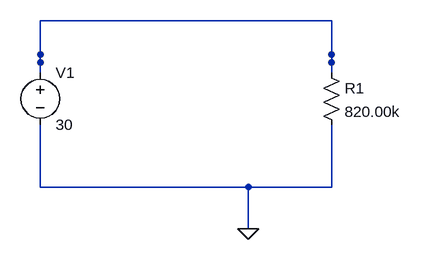
[diagram p0: schematic pannel3.asc]
pannel3.asc, the LTspice schematic file:
Version 4
SHEET 1 880 680
WIRE 640 336 640 308
WIRE 640 448 640 416
SYMBOL res 624 320 R0
SYMATTR InstName R1
SYMATTR Value 820.00k
FLAG 512 576 0
WIRE 192 336 192 308
WIRE 192 448 192 416
SYMBOL voltage 192 320 R0
SYMATTR InstName V1
SYMATTR Value 30
WIRE 448 512 512 512
WIRE 512 512 512 576
WIRE 512 512 576 512
WIRE 192 256 192 320
WIRE 192 256 256 256
WIRE 192 448 192 512
WIRE 192 512 256 512
WIRE 576 256 640 256
WIRE 640 256 640 320
WIRE 576 512 640 512
WIRE 640 448 640 512
WIRE 256 512 320 512
WIRE 320 512 384 512
WIRE 384 512 448 512
WIRE 256 256 320 256
WIRE 320 256 384 256
WIRE 384 256 448 256
WIRE 448 256 512 256
WIRE 512 256 576 256

The netlist it stands for:
* pannel3.asc
R1 N001 0 820.00k
V1 N001 0 30
.backanno
.end